# EAGLE design RHT_Sensor_V2 (EAGLE 9.6.2)
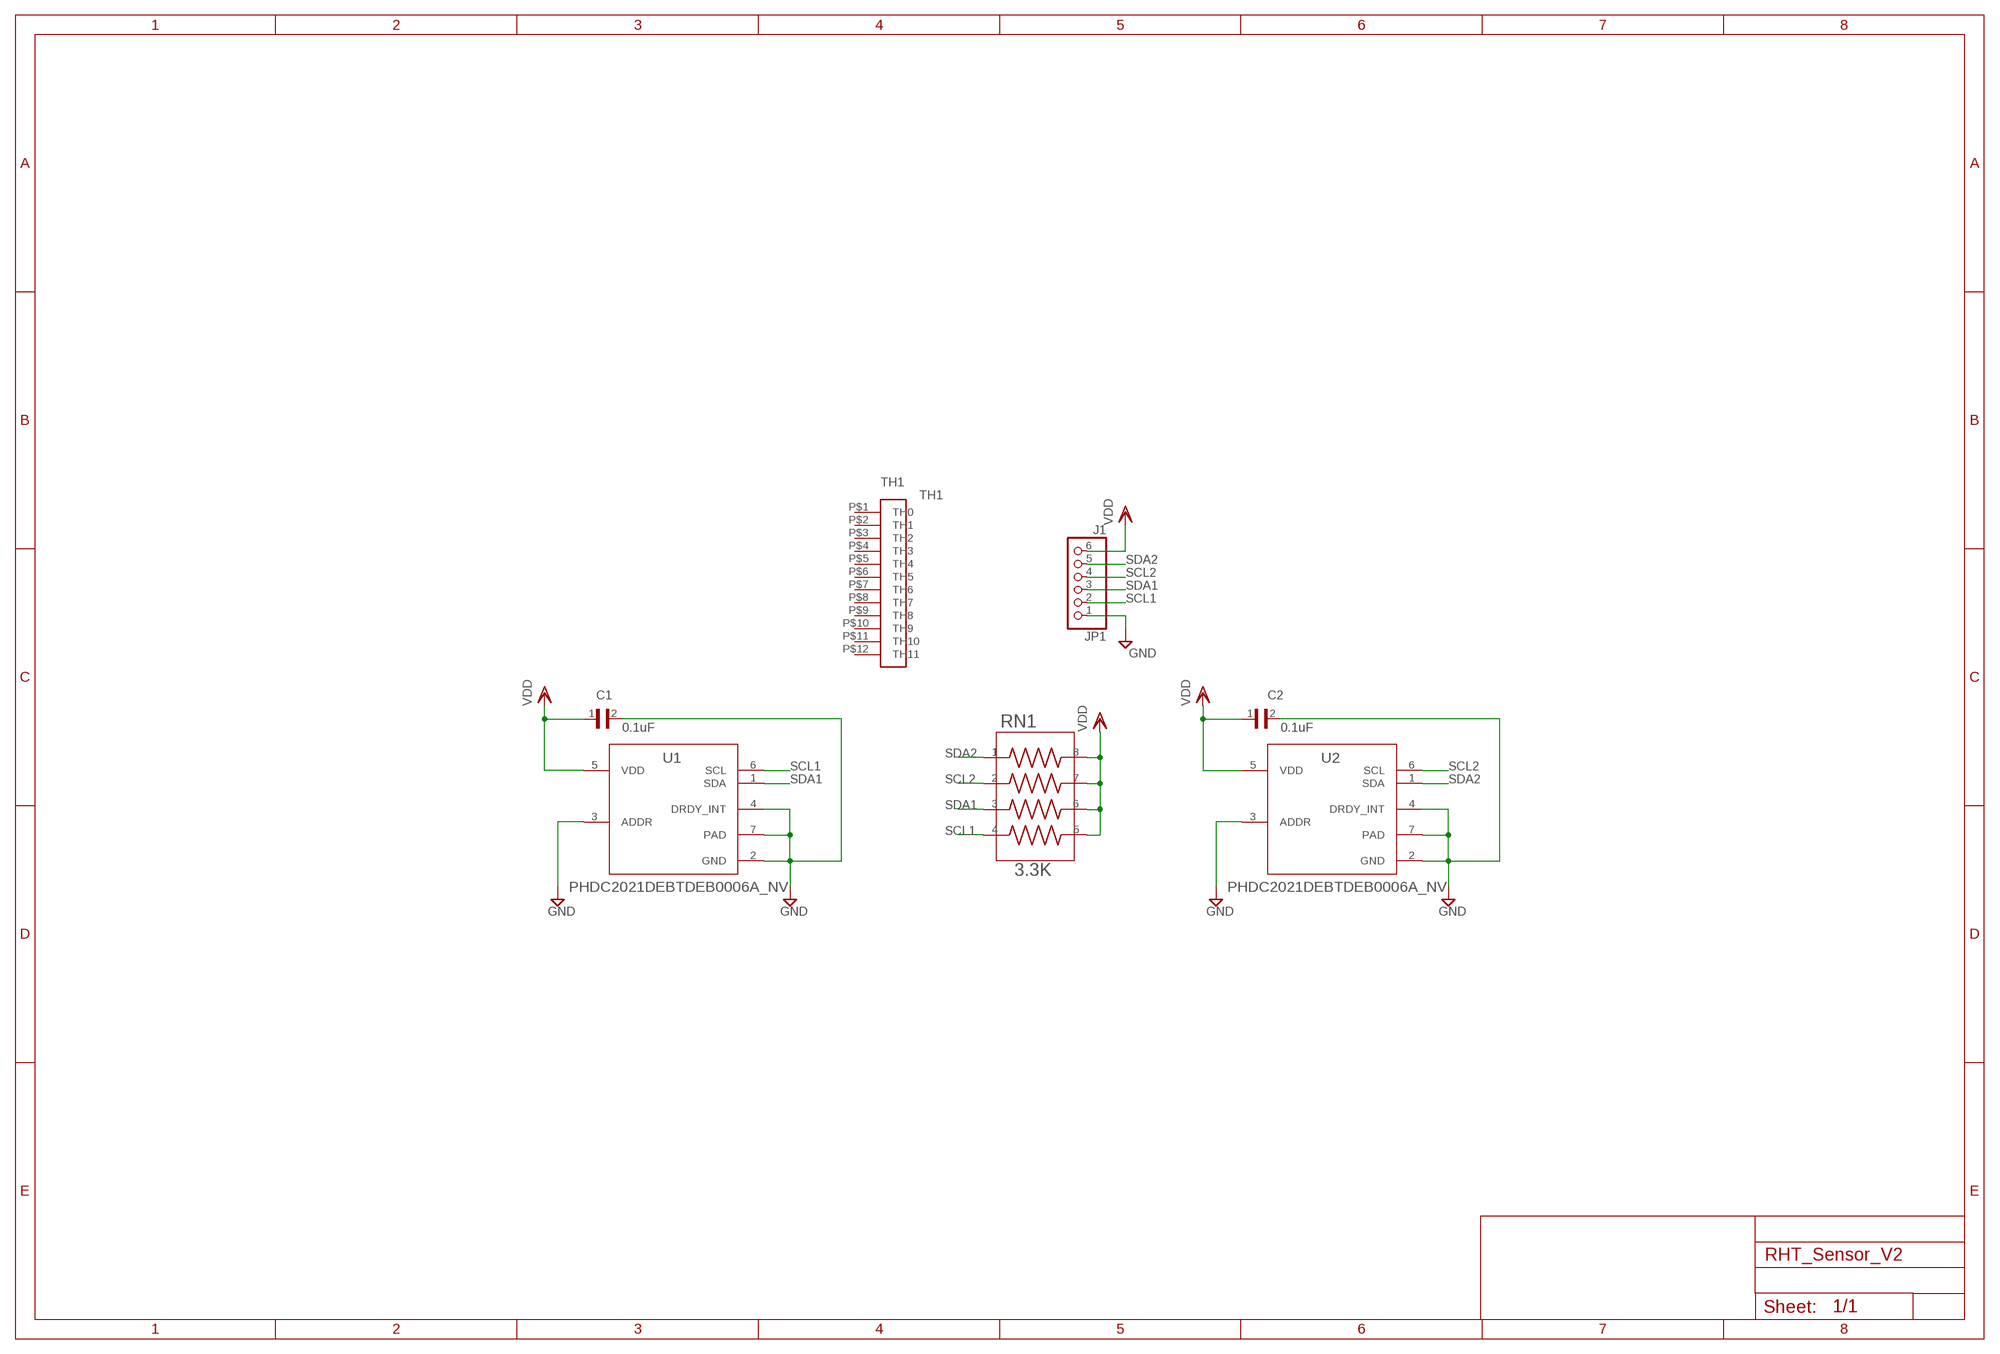
[diagram p0: schematic, sheet 1]

## Parts
C1  0.1uF  08055C104KAT4A  [CAPC2012X94N]
C2  0.1uF  08055C104KAT4A  [CAPC2012X94N]
JP1  J1  PINHD-1X6  [1X06]
RN1  3.3K  CAY16-332J4LF  [RESCAF80P320X160X60-8N]
TH1  TH1  1MM_HEADER-01X12  [1MM_HEADER_01X12]
U1  PHDC2021DEBTDEB0006A_NV  [DEB0006A_NV]
U2  PHDC2021DEBTDEB0006A_NV  [DEB0006A_NV]

## Nets
GND: C1.2 C2.2 JP1.1 U1.2(GND) U1.3(ADDR) U1.4(DRDY_INT) U1.7(PAD) U2.2(GND) U2.3(ADDR) U2.4(DRDY_INT) U2.7(PAD)
SCL1: JP1.2 RN1.4 U1.6(SCL)
SCL2: JP1.4 RN1.2 U2.6(SCL)
SDA1: JP1.3 RN1.3 U1.1(SDA)
SDA2: JP1.5 RN1.1 U2.1(SDA)
VDD: C1.1 C2.1 JP1.6 RN1.5 RN1.6 RN1.7 RN1.8 U1.5(VDD) U2.5(VDD)
Unconnected: TH1.P$1(TH0) TH1.P$2(TH1) TH1.P$3(TH2) TH1.P$4(TH3) TH1.P$5(TH4) TH1.P$6(TH5) TH1.P$7(TH6) TH1.P$8(TH7) TH1.P$9(TH8) TH1.P$10(TH9) TH1.P$11(TH10) TH1.P$12(TH11)

## Library data of the parts
C1 C2 = 08055C104KAT4A:08055C104KAT4A: .1UF 50V 10% 0805; DESCRIPTION: 0.1 µF ±10% 50V Ceramic Capacitor X7R 0805 (2012 Metric); MF: AVX; MP: 08055C104KAT4A; PACKAGE: 2012 AVX
JP1 = pinhead:PINHD-1X6: PIN HEADER
RN1 = CAY16-332J4LF:CAY16-332J4LF: Res Thick Film Array 75 Ohm 5% 0.25W(1/4W) ?200ppm/C ISOL Molded 8-Pin 1206(4 X 0603) Convex SMD T/R; MANUFACTURER: Bourns; STANDARD: IPC-7351B
TH1 = One_mm_01x12:1MM_HEADER-01X12
U1 U2 = untitled:PHDC2021DEBT; COPYRIGHT: Copyright (C) 2023 Ultra Librarian. All rights reserved.; MANUFACTURER_PART_NUMBER: PHDC2021DEBT; MFR_NAME: Texas Instruments; REFDES: RefDes; TYPE: TYPE

## Board
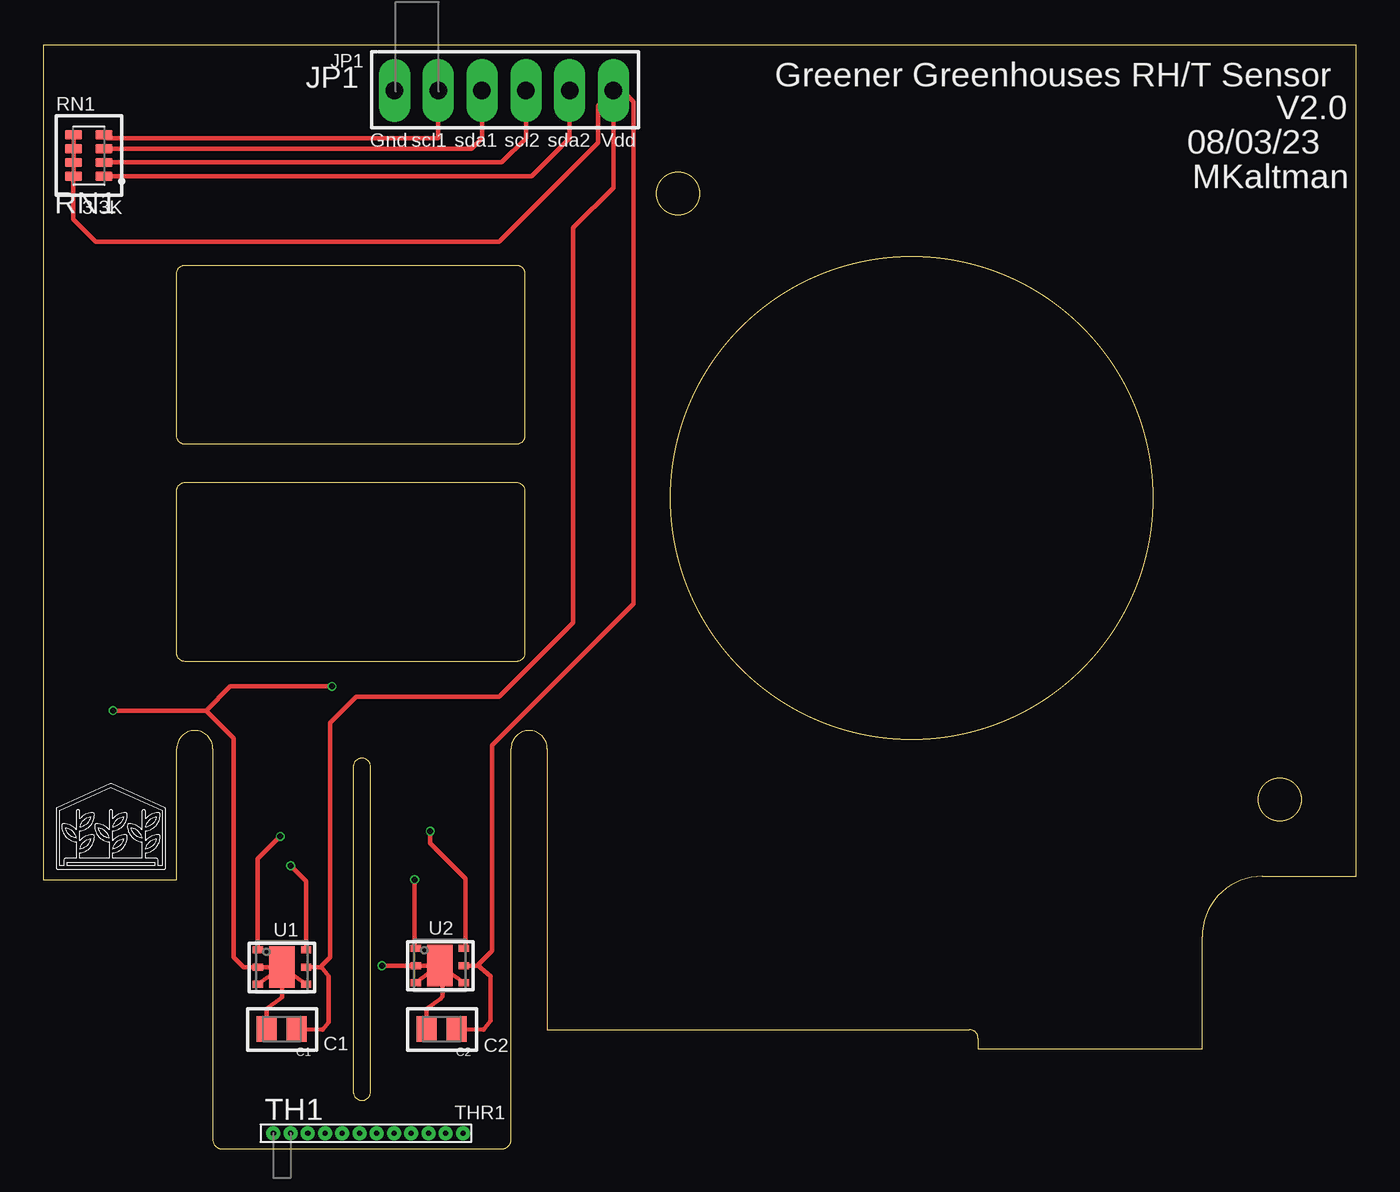
[diagram p1: board, top side]
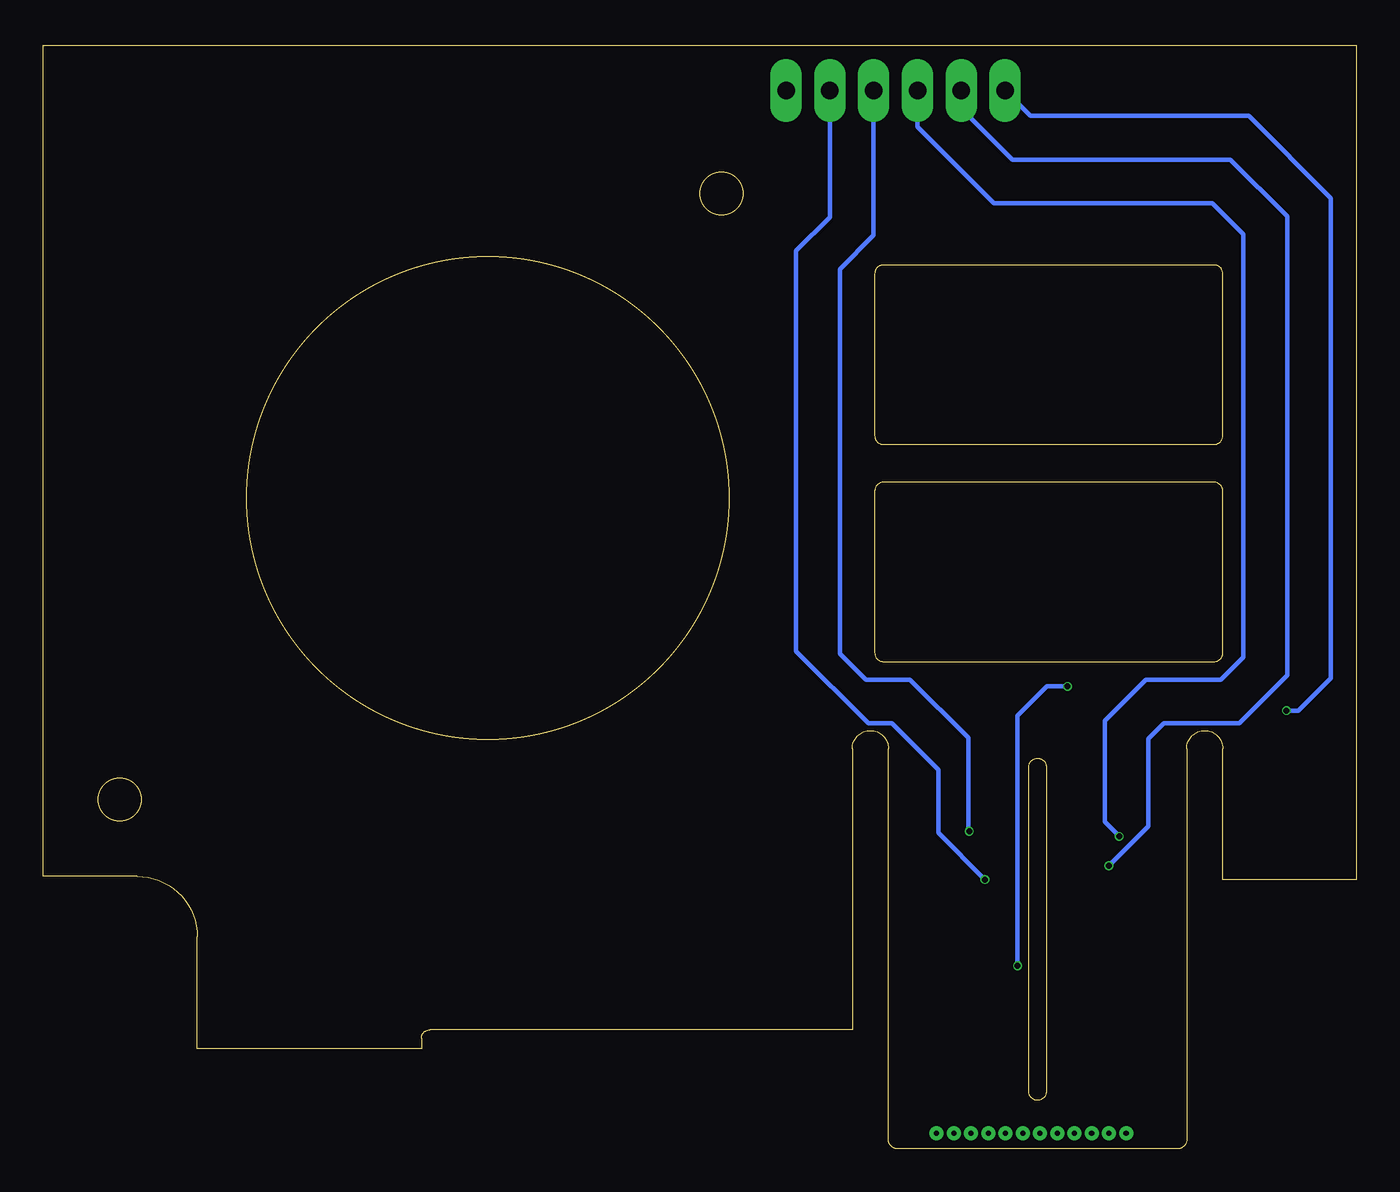
[diagram p2: board, bottom side, seen from below]

Size 76.2 x 64 mm. Coordinates in mm from the lower left corner, seen from the top.
Outline: 26.65,0 arc90 27.15,0.5 27.15,23.2 arc-180 29.25,23.2 29.25,6.9 53.75,6.9 arc-90 54.25,6.4 54.25,5.8 67.25,5.8 67.25,12.3 arc-90 70.75,15.8 76.2,15.8 76.2,64 0,64 0,15.6 7.75,15.6 7.75,23.2 arc-180 9.85,23.2 9.85,0.5 arc90 10.35,0 26.65,0
Outline: 7.75,28.75 7.75,38.15 arc-90 8.25,38.65 27.45,38.65 arc-90 27.95,38.15 27.95,28.75 arc-90 27.45,28.25 8.25,28.25 arc-90 7.75,28.75
Outline: 7.75,41.35 7.75,50.75 arc-90 8.25,51.25 27.45,51.25 arc-90 27.95,50.75 27.95,41.35 arc-90 27.45,40.85 8.25,40.85 arc-90 7.75,41.35
Outline: 18,3.3 arc180 19,3.3 19,22.15 arc180 18,22.15 18,3.3
Outline: circle at 50.4,37.75 radius 14
Outline: circle at 71.75,20.25 radius 1.25
Outline: circle at 36.85,55.4 radius 1.25
Copper layers (1*16): Top 0.035mm / dielectric 1.6mm / Bottom 0.035mm
Design rules "jlcpcb-2layers": minimum track width 5mil, minimum drill 0.3mm, track to track 5mil, track to pad 5mil, pad to pad 5mil, via to via 5mil, smd to smd 5mil, copper to edge 0.2mm, drill to drill 6mil, minimum pad ring 10mil, minimum via ring 3mil, stop-mask expansion 4mil, vias tented up to drill 0mil, thermal gap 10mil

### Footprints (pad centres in the part's own frame; a part is rotated, then mirrored left to right if it is on the bottom)
CAPC2012X94N = smd 1.16 x 1.47: 1 -0.88,0; 2 0.88,0
1X06 = drill 1.016 long: 1 -6.35,0; 2 -3.81,0; 3 -1.27,0; 4 1.27,0; 5 3.81,0; 6 6.35,0
RESCAF80P320X160X60-8N = smd 0.97 x 0.53: 1 -0.875,1.2; 2 -0.875,0.4; 3 -0.875,-0.4; 4 -0.875,-1.2; 5 0.875,-1.2; 6 0.875,-0.4; 7 0.875,0.4; 8 0.875,1.2
1MM_HEADER_01X12 = drill 0.3 pad 0.6: P$1 0,0; P$2 1,0; P$3 2,0; P$4 3,0; P$5 4,0; P$6 5,0; P$7 6,0; P$8 7,0; P$9 8,0; P$10 9,0; P$11 10,0; P$12 11,0
DEB0006A_NV = smd 0.6 x 0.4: 1 -1.4,1; 2 -1.4,0; 3 -1.4,-1; 4 1.4,-1; 5 1.4,0; 6 1.4,1 | smd 1.5 x 2.4: 7 0,0

### Placement (x,y rotation side)
C1  13.84,6.94 180 top
C2  23.12,6.94 180 top
JP1  26.74,61.38 0 top
RN1  2.65,57.6 180 top
TH1  13.36,0.9 0 top
U1  13.86,10.53 0 top
U2  23.02,10.62 0 top

### Tracks (layer width: path | path; a pad name or v marks a point on that pad's centre or on a via)
GND  (via drill 0.35)
  Top 0.254: 22.96,10.62 U2.2 v19.66,10.61 | 22.96,10.62 U2.7 23.08,10.58 23.19,10.5 | U2.3 22.96,10.62 | 23.19,10.5 U2.4 | U1.3 U1.7 | U1.7 U1.2 11.64,10.53 11.06,11.11 11.06,23.81 9.46,25.41 | U1.7 U1.4 | C2.2 22.26,8.11 23.06,8.71 23.19,8.84 23.19,10.5 | C1.2 12.96,8.11 13.86,8.79 U1.7 | v4.06,25.41 9.46,25.41 | 9.46,25.41 10.86,26.81 v16.76,26.81
  Bottom 0.254: JP1.1 18.92,59.91 6.26,59.91 1.48,55.13 1.48,27.29 3.36,25.41 v4.06,25.41 | v16.76,26.81 17.96,26.81 19.66,25.11 v19.66,10.61
SCL1  (via drill 0.35)
  Top 0.254: JP1.2 22.93,58.61 3.71,58.61 RN1.4 | v14.36,16.41 15.26,15.51 U1.6
  Bottom 0.254: JP1.2 22.93,60.33 19.97,57.37 7.31,57.37 4.02,54.08 4.02,27.46 6.81,24.67 11.16,24.67 12.06,23.77 12.06,18.71 v14.36,16.41
SCL2  (via drill 0.35)
  Top 0.254: JP1.4 28.01,58.61 26.6,57.2 RN1.2 | v22.46,18.41 22.46,17.71 24.52,15.65 24.52,11.72 U2.6
  Bottom 0.254: JP1.4 28.01,52.97 29.96,51.01 29.96,28.71 28.46,27.21 25.91,27.21 22.52,23.82 22.52,18.47 v22.46,18.41
SDA1  (via drill 0.35)
  Top 0.254: JP1.3 25.47,58.61 24.86,58 RN1.3 | v13.76,18.11 12.46,16.81 U1.1
  Bottom 0.254: JP1.3 25.47,59.28 21.02,54.83 8.36,54.83 6.56,53.03 6.56,28.51 7.86,27.21 12.21,27.21 14.6,24.82 14.6,18.95 v13.76,18.11
SDA2  (via drill 0.35)
  Top 0.254: JP1.5 30.55,58.61 28.34,56.4 RN1.1 | v21.56,15.61 21.56,11.68 U2.1
  Bottom 0.254: JP1.5 30.55,54.02 32.5,52.07 32.5,28.86 28.31,24.67 26.96,24.67 24.26,21.97 24.26,18.31 v21.56,15.61
VDD
  Top 0.254: 16.16,10.51 16.56,10.01 16.55,7.33 16.22,6.91 C1.1 | C2.1 25.56,6.91 25.96,7.41 25.96,10.01 25.22,10.63 | JP1.6 32.19,60.48 32.19,58.34 26.46,52.61 3.06,52.61 1.76,53.91 1.76,56.38 RN1.8 RN1.7 RN1.6 RN1.5 | U1.5 16.14,10.53 16.16,10.51 | U2.5 25.21,10.62 25.22,10.63 | JP1.6 33.59,61.38 34.26,60.71 34.26,31.61 26.06,23.41 26.06,11.47 25.22,10.63 | JP1.6 33.09,55.74 30.76,53.41 30.76,30.51 26.46,26.21 18.16,26.21 16.66,24.71 16.66,24.01 16.66,23.91 16.66,11.11 16.16,10.61 16.16,10.51

### Text on the board
tPlace: JP1 | Greener Greenhouses RH/T Sensor | RN1 | V2.0 | Gnd | scl1 | sda1 | scl2 | sda2 | Vdd | 08/03/23 | MKaltman | 3.3K | U1 | U2 | C1 | C2 | THR1